# Altium schematic sheet Wifi.SchDoc
size A
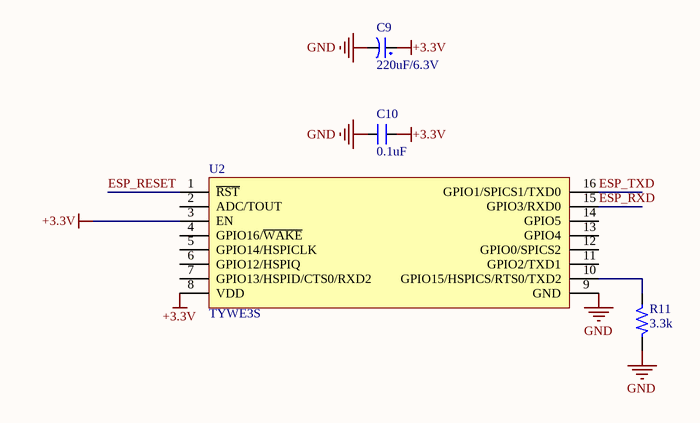
[diagram p0: Wifi.SchDoc]

## Parts
C9  220uF/6.3V  [C2917]
C10  0.1uF  [C0603]
R11  3.3k  [R0603]
U2  TYWE3S  [ESP_07]

## Nets
+3.3V: C9.1 C10.2 U2.3(EN) U2.8(VDD)
GND: C9.2 C10.1 R11.2 U2.9(GND)
ESP_RESET: U2.1(~{RST})
ESP_RXD: U2.15(GPIO3/RXD0)
ESP_TXD: U2.16(GPIO1/SPICS1/TXD0)
NetR11_1: R11.1 U2.10(GPIO15/HSPICS/RTS0/TXD2)

Not connected (* = marked no-connect by the designer): U2 2(ADC/TOUT) 4(GPIO16/~{WAKE}) 5(GPIO14/HSPICLK) 6(GPIO12/HSPIQ) 7(GPIO13/HSPID/CTS0/RXD2) 11(GPIO2/TXD1) 12(GPIO0/SPICS2) 13(GPIO4) 14(GPIO5)

## Library data of the parts
C9 = CP1: Cap P  0,1uF < 22uF , 16 - 50V; Value: 10uF/50V; Description 1: 10 => 220uF/6,3V/10V - 10uF => 100uF/16V; Description 2: 0,1uF => 33uF/50V - 10uF => 22uF/63V; Description 3: 0,47uF => 10uF/100V
C10 = CM: Cap SMD; Value: 103
R11 = R: Resistor 1/4W; Value: R1/4W - 1K
U2 = ESP_07: ESP-12 Wi-Fi Module by AI-Thinker; IC: ESP8266-EX; Vendor: Ai-thinker; Link: https://world.taobao.com/item/43741891870.htm?spm=a312a.7700714.0.0.F3BsVx#detail